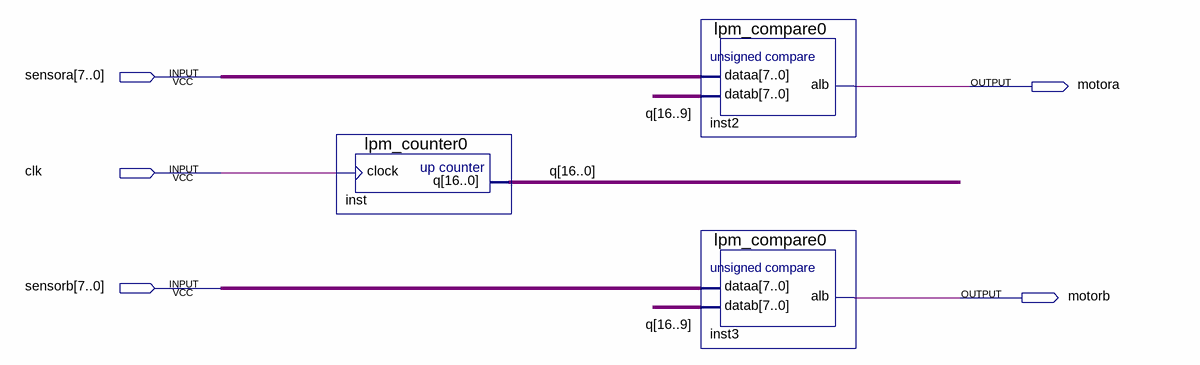
[diagram p0: schematic sheet]
// Quartus schematic colete.bdf as structural Verilog: 3 symbols, 5 pins
module colete (
  input  [7:0] sensora,
  input  clk,
  input  [7:0] sensorb,
  output motora,
  output motorb
);

  wire [16:0] q;

  lpm_counter0 inst (.clock(clk), .q(q));
  lpm_compare0 inst2 (.dataa(sensora), .datab(q[16:9]), .alb(motora));
  lpm_compare0 inst3 (.dataa(sensorb), .datab(q[16:9]), .alb(motorb));
endmodule
